# EAGLE design PoE_Atmega_REVC (EAGLE 8.6.0)
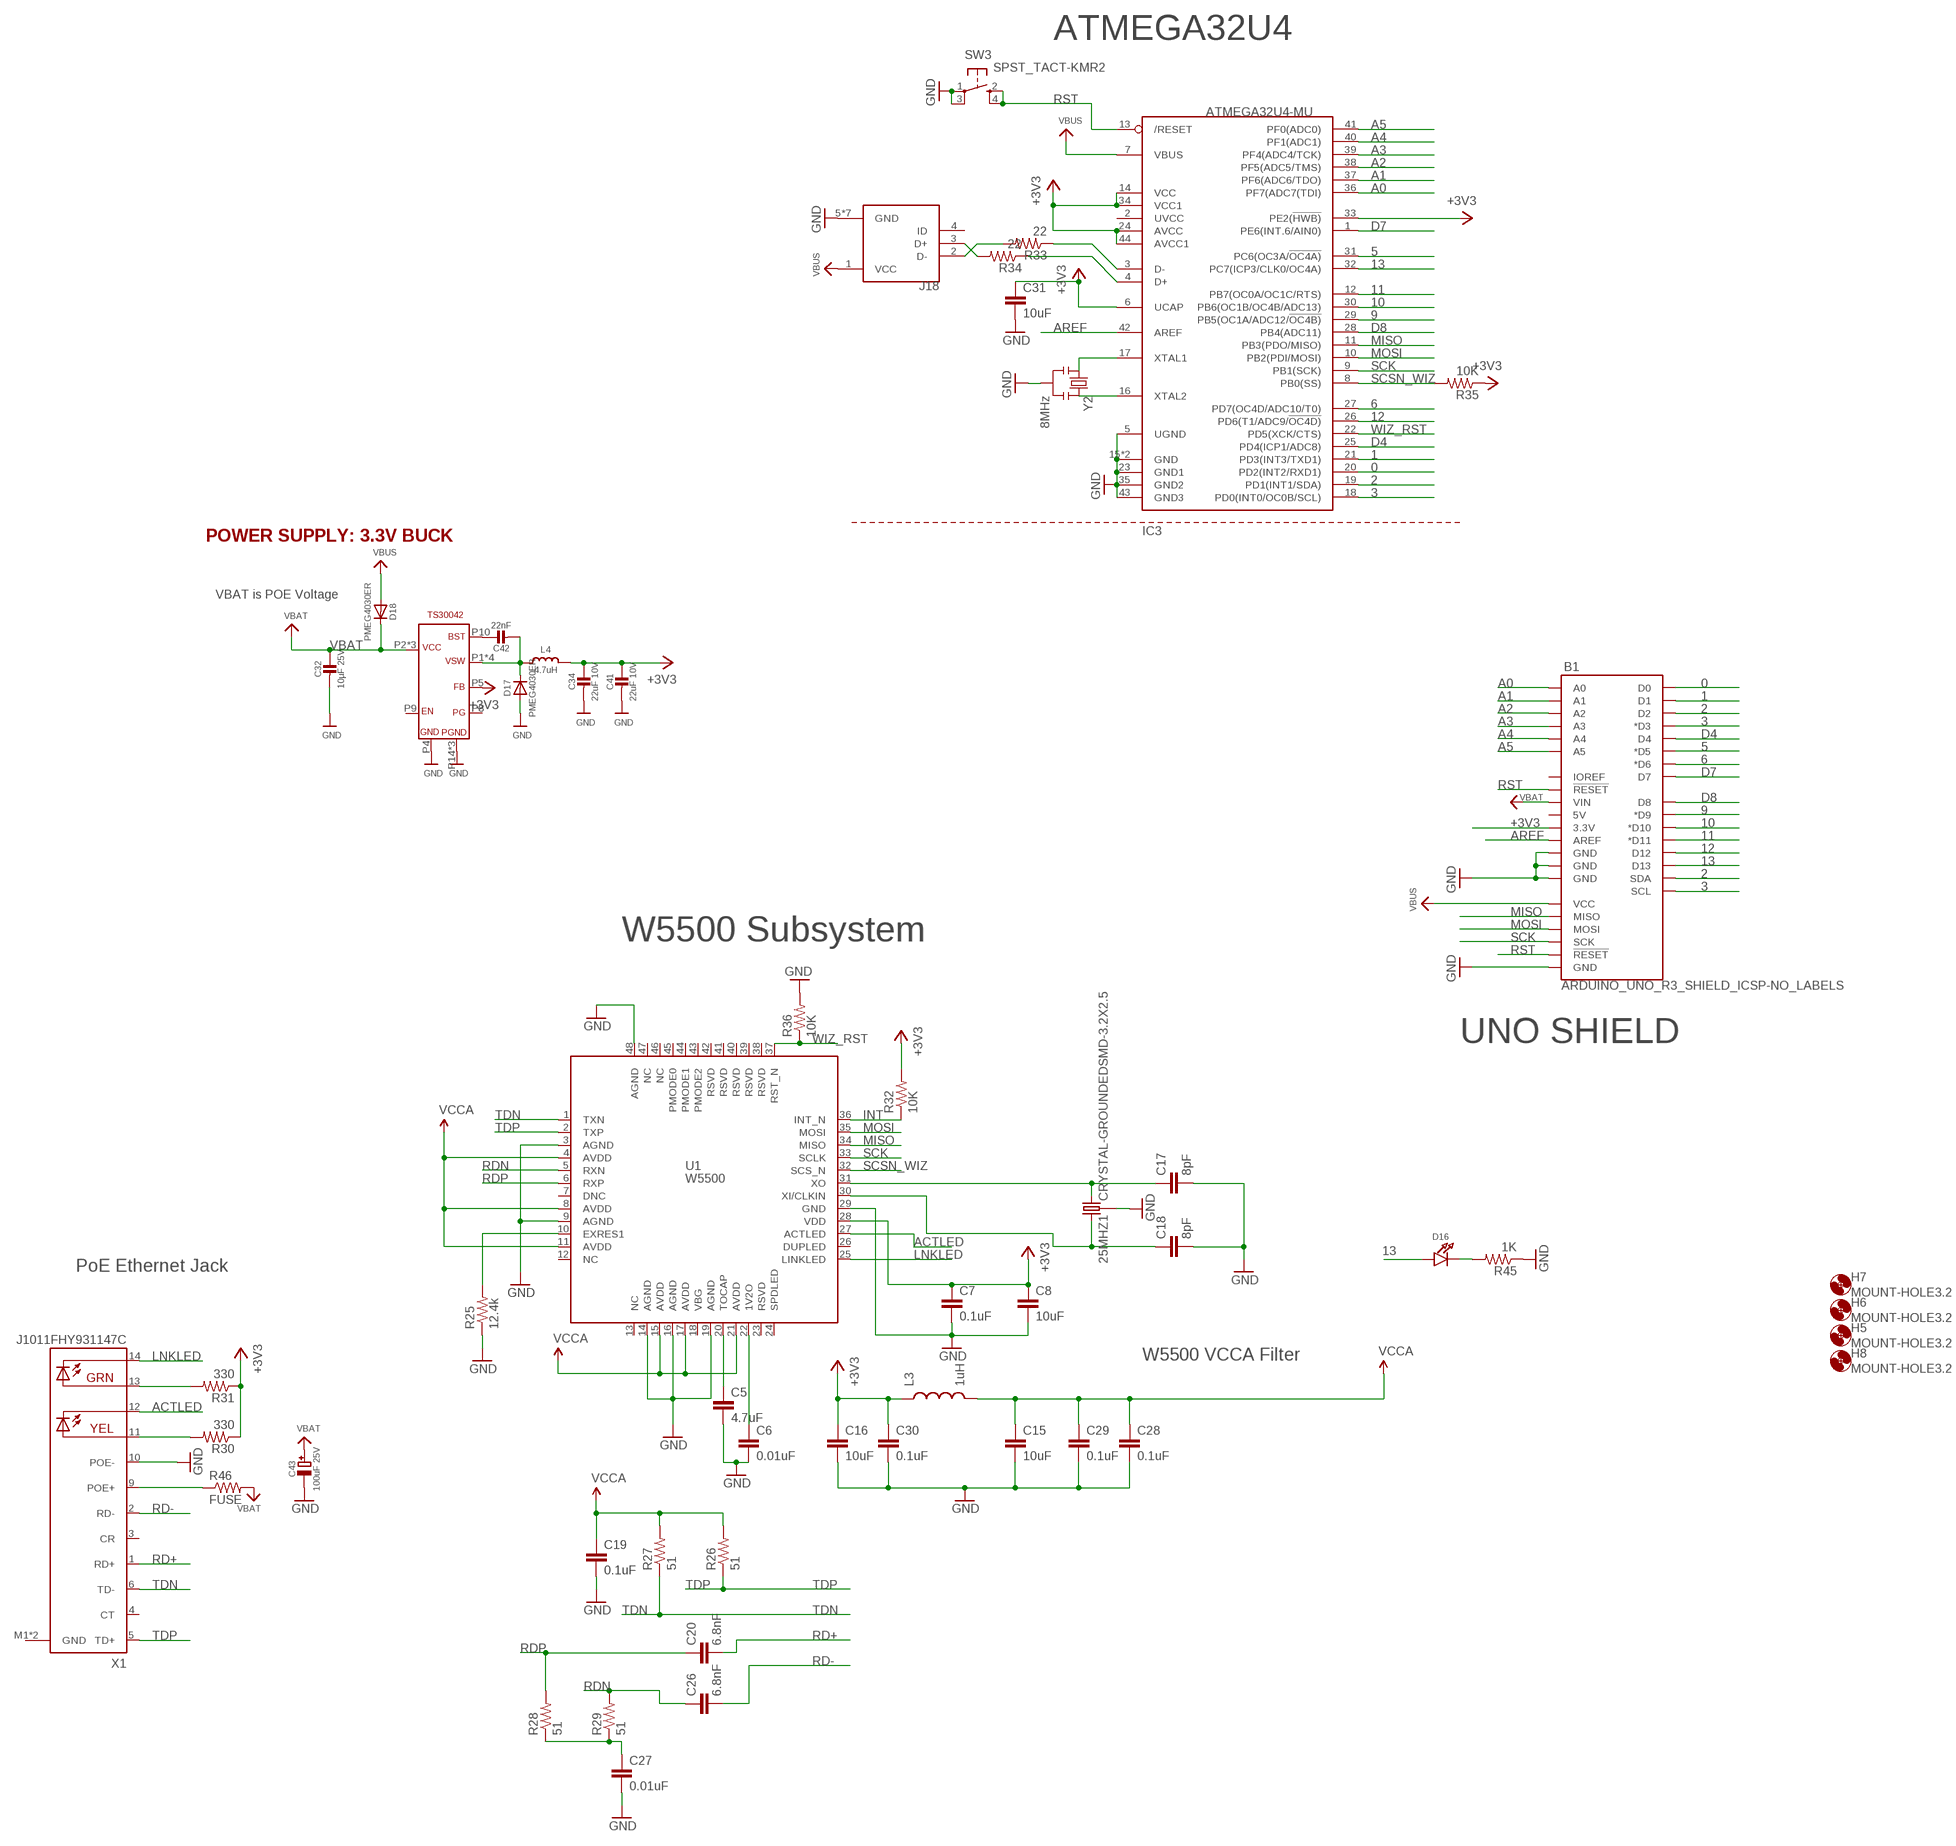
[diagram p0: schematic, sheet 1]

## Parts
25MHZ1  CRYSTAL-GROUNDEDSMD-3.2X2.5  [CRYSTAL-SMD-3.2X2.5MM]
B1  ARDUINO_UNO_R3_SHIELD_ICSP-NO_LABELS  [UNO_R3_SHIELD_ICSP_NOLABELS]
C5  4.7uF  CAP0603-CAP  [0603-CAP]
C6  0.01uF  CAP0603-CAP  [0603-CAP]
C7  0.1uF  CAP0603-CAP  [0603-CAP]
C8  10uF  CAP0603-CAP  [0603-CAP]
C15  10uF  CAP0603-CAP  [0603-CAP]
C16  10uF  CAP0603-CAP  [0603-CAP]
C17  8pF  CAP0603-CAP  [0603-CAP]
C18  8pF  CAP0603-CAP  [0603-CAP]
C19  0.1uF  CAP0603-CAP  [0603-CAP]
C20  6.8nF  CAP0603-CAP  [0603-CAP]
C26  6.8nF  CAP0603-CAP  [0603-CAP]
C27  0.01uF  CAP0603-CAP  [0603-CAP]
C28  0.1uF  CAP0603-CAP  [0603-CAP]
C29  0.1uF  CAP0603-CAP  [0603-CAP]
C30  0.1uF  CAP0603-CAP  [0603-CAP]
C31  10uF  CAP0603-CAP  [0603-CAP]
C32  10µF 25V  CAP_CERAMIC0603MINI  [0603-MINI]
C34  22uF 10V  CAP_CERAMIC0603MINI  [0603-MINI]
C41  22uF 10V  CAP_CERAMIC0603MINI  [0603-MINI]
C42  22nF  CAP_CERAMIC0603MINI  [0603-MINI]
C43  100uF 25V  CAP_ELECTROLYTICPANASONIC_D  [PANASONIC_D]
D16  LED0805_NOOUTLINE  [CHIPLED_0805_NOOUTLINE]
D17  PMEG4030ER  DIODESOD-123  [SOD-123]
D18  PMEG4030ER  DIODESOD-123  [SOD-123]
H5  MOUNT-HOLE3.2  [3,2]
H6  MOUNT-HOLE3.2  [3,2]
H7  MOUNT-HOLE3.2  [3,2]
H8  MOUNT-HOLE3.2  [3,2]
IC3  ATMEGA32U4-MU  [TQFN44_7MM]
J18  10103594-0001LF  [FCI_10103594-0001LF]
L3  1uH  INDUCTOR0603  [0603]
L4  4.7uH  INDUCTORTDK_VLC5045  [INDUCTOR_5X5MM_TDK_VLC5045]
R25  12.4k  RESISTOR0603-RES  [0603-RES]
R26  51  RESISTOR0603-RES  [0603-RES]
R27  51  RESISTOR0603-RES  [0603-RES]
R28  51  RESISTOR0603-RES  [0603-RES]
R29  51  RESISTOR0603-RES  [0603-RES]
R30  330  RESISTOR0603-RES  [0603-RES]
R31  330  RESISTOR0603-RES  [0603-RES]
R32  10K  RESISTOR0603-RES  [0603-RES]
R33  22  RESISTOR0603-RES  [0603-RES]
R34  22  RESISTOR0603-RES  [0603-RES]
R35  10K  RESISTOR0603-RES  [0603-RES]
R36  10K  RESISTOR0603-RES  [0603-RES]
R45  1K  RESISTOR0603-RES  [0603-RES]
R46  FUSE  RESISTOR0603-RES  [0603-RES]
SW3  SPST_TACT-KMR2  [KMR2]
U1  W5500  [W5500]
U$44  BUCK_CONVERTER  [QFN-16]
X1  J1011FHY931147C  [HANRUN_POE]
Y2  8MHz  RESONATORSMD  [RESONATOR-SMD]

## Nets
0: B1.RX(D0) IC3.20(PD2(INT2/RXD1))
1: B1.TX(D1) IC3.21(PD3(INT3/TXD1))
2: B1.D2 B1.SDA IC3.19(PD1(INT1/SDA))
3: B1.D3(*D3) B1.SCL IC3.18(PD0(INT0/OC0B/SCL))
5: B1.D5(*D5) IC3.31(PC6(OC3A/!OC4A))
6: B1.D6(*D6) IC3.27(PD7(OC4D/ADC10/T0))
9: B1.D9(*D9) IC3.29(PB5(OC1A/ADC12/!OC4B))
10: B1.D10(*D10) IC3.30(PB6(OC1B/OC4B/ADC13))
11: B1.D11(*D11) IC3.12(PB7(OC0A/OC1C/RTS))
12: B1.D12 IC3.26(PD6(T1/ADC9/!OC4D))
13: B1.D13 D16.A IC3.32(PC7(ICP3/CLK0/OC4A))
+3V3: B1.3.3V C7.1 C8.1 C16.1 C30.1 C31.1 C34.1 C41.1 IC3.6(UCAP) IC3.14(VCC) IC3.24(AVCC) IC3.33(PE2(!HWB)) IC3.34(VCC1) IC3.44(AVCC1) L3.1 L4.P$2 R30.1 R31.1 R32.2 R35.1 U1.28(VDD) U$44.P5(FB)
A0: B1.A0 IC3.36(PF7(ADC7(TDI))
A1: B1.A1 IC3.37(PF6(ADC6/TDO))
A2: B1.A2 IC3.38(PF5(ADC5/TMS))
A3: B1.A3 IC3.39(PF4(ADC4/TCK))
A4: B1.A4 IC3.40(PF1(ADC1))
A5: B1.A5 IC3.41(PF0(ADC0))
ACTLED: U1.27(ACTLED) X1.12(YEL-C)
AREF: B1.AREF IC3.42(AREF)
D4: B1.D4 IC3.25(PD4(ICP1/ADC8))
D7: B1.D7 IC3.1(PE6(INT.6/AIN0))
D8: B1.D8 IC3.28(PB4(ADC11))
D+2: IC3.4(D+) R34.1
D-2: IC3.3(D-) R33.1
GND: 25MHZ1.2 25MHZ1.4 B1.GND@0(GND) B1.GND@1(GND) B1.GND@2(GND) B1.GND_ICSP(GND) C5.2 C6.2 C7.2 C8.2 C15.2 C16.2 C17.2 C18.2 C19.2 C27.2 C28.2 C29.2 C30.2 C31.2 C32.2 C34.2 C41.2 C43.- D17.A IC3.5(UGND) IC3.15(GND) IC3.23(GND1) IC3.35(GND2) IC3.43(GND3) IC3.THERMAL(GND) J18.5(GND) J18.P1(GND) J18.P2(GND) J18.P3(GND) J18.P4(GND) J18.P5(GND) J18.P6(GND) R25.1 R36.2 R45.1 SW3.1(P) SW3.3(P1) U1.3(AGND) U1.9(AGND) U1.14(AGND) U1.16(AGND) U1.19(AGND) U1.29(GND) U1.48(AGND) U$44.P4(GND) U$44.P14(PGND) U$44.P15(PGND) U$44.PAD(PGND) X1.10(POE-) Y2.2
INT: R32.1 U1.36(INT_N)
LNKLED: U1.25(LINKLED) X1.14(GRN-C)
MISO: B1.MISO IC3.11(PB3(PDO/MISO)) U1.34(MISO)
MOSI: B1.MOSI IC3.10(PB2(PDI/MOSI)) U1.35(MOSI)
N$22: C5.1 U1.20(TOCAP)
N$24: C6.1 U1.22(1V2O)
N$27: R25.2 U1.10(EXRES1)
N$28: C27.1 R28.1 R29.1
N$29: 25MHZ1.3 C17.1 U1.31(XO)
N$30: 25MHZ1.1 C18.1 U1.30(XI/CLKIN)
N$31: IC3.16(XTAL2) Y2.3
N$32: IC3.17(XTAL1) Y2.1
N$33: J18.3(D+) R34.2
N$34: J18.2(D-) R33.2
N$39: D16.C R45.2
N$40: R31.2 X1.13(GRN-A)
N$41: R30.2 X1.11(YEL-A)
N$42: C42.1 U$44.P10(BST)
N$43: C42.2 D17.C L4.P$1 U$44.P1(VSW) U$44.P12(VSW) U$44.P13(VSW) U$44.P16(VSW)
N$44: R46.1 X1.9(POE+)
RD+: C20.2 X1.1(RD+)
RD-: C26.2 X1.2(RD-)
RDN: C26.1 R29.2 U1.5(RXN)
RDP: C20.1 R28.2 U1.6(RXP)
RST: B1.RES(!RESET!) B1.RST_ICSP(!RESET!) IC3.13(/RESET) SW3.2(S) SW3.4(S1)
SCK: B1.SCK IC3.9(PB1(SCK)) U1.33(SCLK)
SCSN_WIZ: IC3.8(PB0(SS)) R35.2 U1.32(SCS_N)
TDN: R27.1 U1.1(TXN) X1.6(TD-)
TDP: R26.1 U1.2(TXP) X1.5(TD+)
VBAT: B1.VIN C32.1 C43.+ D18.C R46.2 U$44.P2(VCC) U$44.P3(VCC) U$44.P11(VCC)
VBUS: B1.5V_ICSP(VCC) D18.A IC3.7(VBUS) J18.1(VCC)
VCCA: C15.1 C19.1 C28.1 C29.1 L3.2 R26.2 R27.2 U1.4(AVDD) U1.8(AVDD) U1.11(AVDD) U1.15(AVDD) U1.17(AVDD) U1.21(AVDD)
WIZ_RST: IC3.22(PD5(XCK/CTS)) R36.1 U1.37(RST_N)
Unconnected: B1.5V B1.IOREF IC3.2(UVCC) J18.4(ID) U1.7(DNC) U1.12(NC) U1.13(NC) U1.18(VBG) U1.23(RSVD) U1.24(SPDLED) U1.26(DUPLED) U1.38(RSVD) U1.39(RSVD) U1.40(RSVD) U1.41(RSVD) U1.42(RSVD) U1.43(PMODE2) U1.44(PMODE1) U1.45(PMODE0) U1.46(NC) U1.47(NC) U$44.P8(PG) U$44.P9(EN) X1.3(CR) X1.4(CT)

## Notes on the sheet
- ATMEGA32U4
- POWER SUPPLY: 3.3V BUCK
- VBAT is POE Voltage
- W5500 Subsystem
- UNO SHIELD
- PoE Ethernet Jack
- W5500 VCCA Filter

## Power pins joined to a net without a drawn wire
GND: X1.M1(GND) X1.M2(GND)

## Library data of the parts
25MHZ1 = SparkFun-Clocks:CRYSTAL-GROUNDED: Crystals w/ Ground Pin (Generic) These are passive quartz crystals, which can be used as a clock source for a microcontroller. Crystal's are usually two-terminal devices. A third terminal may be optionally connected to ground, as recommended by the manufaturer.
B1 = SparkFun-Boards:ARDUINO_UNO_R3_SHIELD_ICSP: Arduino R3 Shield Footprint with ICSP Header Includes pins for 6-pin (2x3) ICSP Header. Compatible with Leonardo boards that require SPI pin connections via this header. SparkFun Products: CryptoShield <https://www.sparkfun.com/products/13183> microSD Shield <https://www.sparkfun.com/products/12761> R3 Stackable Headers Kit <https://www.sparkfun.com/products/1417>
C5-C8 C15-C20 C26-C31 = SparkFun-Passives:CAP: Capacitor Standard 0603 ceramic capacitor, and 0.1" leaded capacitor.
C32 C34 C41 C42 = microbuilder:CAP_CERAMIC: Ceramic Capacitors For new designs, use the packages preceded by an '_' character since they are more reliable: The following footprints should be used on most boards: _0402 - Standard footprint for regular board layouts _0603 - Standard footprint for regular board layouts _0805 - Standard footprint for regular board layouts _1206 - Standard footprint for regular board layouts For extremely tight-pitch boards where space is at a premium, the following 'micro-pitch' footprints can be used (smaller pads, no silkscreen outline, etc.): _0402MP - Micro-pitch footprint for very dense/compact boards _0603MP - Micro-pitch footprint for very dense/compact boards _0805MP - Micro-pitch footprint for very dense/compact boards _1206MP - Micro-pitch footprint for very dense/compact boards
C43 = microbuilder:CAP_ELECTROLYTIC: Electrolytic Capacitors SMT PANASONIC_C - Size C Panasonic Electrolytic Aluminum Capacitor 47µF 16V 20% Electrolytic Capacitor [Digikey: PCE3890TR-ND] PANASONIC_D - Size D Panasonic Electrolytic Aluminum Capacitor 100µF 25V 20% Electrolytic Capacitor [Digikey: PCE3898TR-ND] PTH 3.5 mm grid, 8 mm diameter ... 3.5 mm grid, 10 mm diameter ...
D16 = microbuilder:LED: LED 0603 - 0603 Surface Mount Package 2mA: Green LED - Low Power (3.9mcd, 2ma, 1.7Vf) - Digikey: 475-2709-2-ND Orange LED - Low Power (9.8mcd, 2ma, 1.8Vf) - Digikey: 475-1194-2-ND Red LED - Low Power (5mcd, 2ma, 1.8Vf) - Digikey: 475-1195-2-ND Yellow LED - Low Power (7mcd, 2ma, 1.8Vf) - Digikey: 475-1196-2-ND 5mA: Blue LED - Low Power (17mcd, 5ma, 2.9Vf) - Digikey: LNJ937W8CRACT-ND 0805 - 0805 Surface Mount Package 2mA: Red LED (8.8mcd, 2mA, 1.8Vf, Clear) - Low Power [Digikey: 475-2510-1-ND] Green LED (5mcd, 2mA, 1.8Vf, Clear) - Low Power [Digikey: 475-2730-1-ND] Yellow LED (11.3mcd, 2mA, 1.8Vf, Clear) - Low Power [Digikey: 475-2555-1-ND] 20mA: Red LED (104mcd, 20mA, Diffused) - LS R976 [Digikey: 475-1278-6-ND] Red LED (12mcd, 20mA, 2.0Vf, Clear) - APT2012EC [Digikey: 754-1128-1-ND] Green LED (15mcd, 20mA, 2.2Vf, Clear) - APT2012GC [Digikey: 754-1131-1-ND] Orange LED (160mcd, 20mA, 2.1Vf, Clear) - APT2012SECK [Digikey: 754-1130-1-ND] 1206 - 1206 Surface Mount Package Green LED (26mcd, 20mA, Diffused) - LG N971 [Digikey: 475-1407-6-ND] Red LED (15mcd, 20mA, Diffused) - LH N974 [Digikey: 475-1416-6-ND] Cree - Cree High-Power Surface Mount LEDs XPEBWT-L1-0000-00D50 - White 111lm 350mA 2.9Vf 6200K 110° XTEAWT-00-0000-00000LEE3 - White 114lm 350mA 2.85Vf 5000K 115° Everlight - Everlight 45-21 Series Surface Mount LEDs 45-21/QK2C-B2832AC2CB2/2T - Warm White 2000mcd 20mA 3.25Vf 3050K 120° 45-21/LK2C-B38452C4CB2/2T - Nuetral White 2000mcd 20mA 3.25Vf 4150K 120° 45-21/LK2C-B50634C6CB2/2T - Cold White 2200mcd 20mA 3.25Vf 5650K 120° PLCC2 Reverse Mount LS T77K-J1L2-1-0-2-R18-Z - Red 11.25mcd 2mA 1.8Vf 630nm 120° LO T77K-L1M2-24-Z - Orange 19.6mcd 2mA 1.8Vf 606nm 120° LY T77K-K2M1-26-Z - Yellow 15.7mcd 2mA 1.8Vf 587nm 120°
D17 D18 = microbuilder:DIODE: Diode SMA Model Volts Amps Type Vf Ir Digikey # Notes SSA34-E3 40V 3A Schottky 480mV @ 3A 200uA @ 40V SSA34-E3/61TGITR-ND CDBA120-G 20V 1A Schottky 500mV @ 1A 500uA @ 20V 641-1014-6-ND REEL MBRA210 10V 2A Schottky 350mV @ 2A 700uA @ 10V MBRA210LT3 SOD-123 Model Volts Amps Type Vf Ir Order # Notes BAT54T1G 30V 200mA Schottky 800mV @ 200mA 2uA @ 25V BAT54T1GOSTR-ND B0530W 30V 500mA Schottky 430mV @ 500mA 130uA @ 30V B0530W-FDICT-ND REEL MBR120 20V 1A Schottky 340mV @ 1A MBR120VLSFT1GOSCT-ND SOD-323 Model Volts Amps Type Vf Ir Order # Notes PMEG2005EJ 20V 500mA Schottky 355mV @ 500mA 568-4110-1-ND ZLLS410 10V 570mA Schottky 380mV @ 570mA ZLLS410CT-ND 1N4148WS 75V 150mA Silicon/Simple 1V 1N4148WSFSCT-ND REEL SOD-523 Model Volts Amps Type Vf Ir Order # Notes BAT54XV2 30V 200mA Schottky 0.8V @ 100mA BAT54XV2CT-ND TB751S 30V 30mA Schottky RB751S-40TE61CT-ND SOT23-R/W (R = Solder Paste/Reflow Ovens, W = Hand-Soldering) Model Volts Amps Type Vf Ir Order # Notes BAT54FILM 40V 300mA Schottky 497-7162-1-ND POWERDI-5 Model Volts Amps Type Vf Ir Order # Notes PDS560 60V 5A Schottky 670mV @ 5A 150uA @ 60V PDS560DICT-ND
H5-H8 = holes:MOUNT-HOLE: MOUNTING HOLE with drill center marker
IC3 = microbuilder:ATMEGA32U4: http://www.ladyada.net/library/eagle
J18 = 10103594-0001LF:10103594-0001LF: Conn Micro USB Type B RCP 5 POS 0.65mm Solder RA SMD 5 Terminal 1 Port T/R; AVAILABILITY: Good; DESCRIPTION: Conn Micro USB Type B RCP 5 POS 0.65mm Solder RA SMD 5 Terminal 1 Port T/R; MF: FCI; MP: 10103594-0001LF; PACKAGE: None; PRICE: 0.40 USD
L3 = SparkFun-Passives:INDUCTOR: Inductors
L4 = microbuilder:INDUCTOR: Inductors
R25-R36 R45 R46 = SparkFun-Passives:RESISTOR: Resistor Basic schematic elements and footprints for 0603, 1206, and PTH resistors.
SW3 = adafruit:SPST_TACT: SMT 6mm switch, EVQQ2 series http://www.ladyada.net/library/eagle
U1 = W5500:W5500
U$44 = Heep:BUCK_CONVERTER
X1 = Heep:J1011F: PULSEJACK (TM) 1x1 Tab-UP RJ45 10/100 Base-TX RJ45 1x1 Tab-UP with LEDs 8-pin (J1 series) and 6-pin (JP series) integrated magnetics connector, designed to support applications, such as ADSL modems, LAN-on-Motherboard, and Hub and Switches. Source: www.pulseeng.com .. PulseJack-J402.pdf
Y2 = SparkFun:RESONATOR: Resonator Small SMD resonator. This is the itty bitty 10/20MHz resonators with built in caps. CSTCE10M0G55 and CSTCE20M0V53. Footprint has been reviewed closely but hasn't been tested yet.

## Net classes
1 power: width 0.305 mm, drill 0.483 mm, clearance 0.203 mm
2 gnd: width 0.305 mm, drill 0.483 mm, clearance 0.203 mm
3 usbvcc: width 0.305 mm, drill 0.483 mm, clearance 0.203 mm

## Board
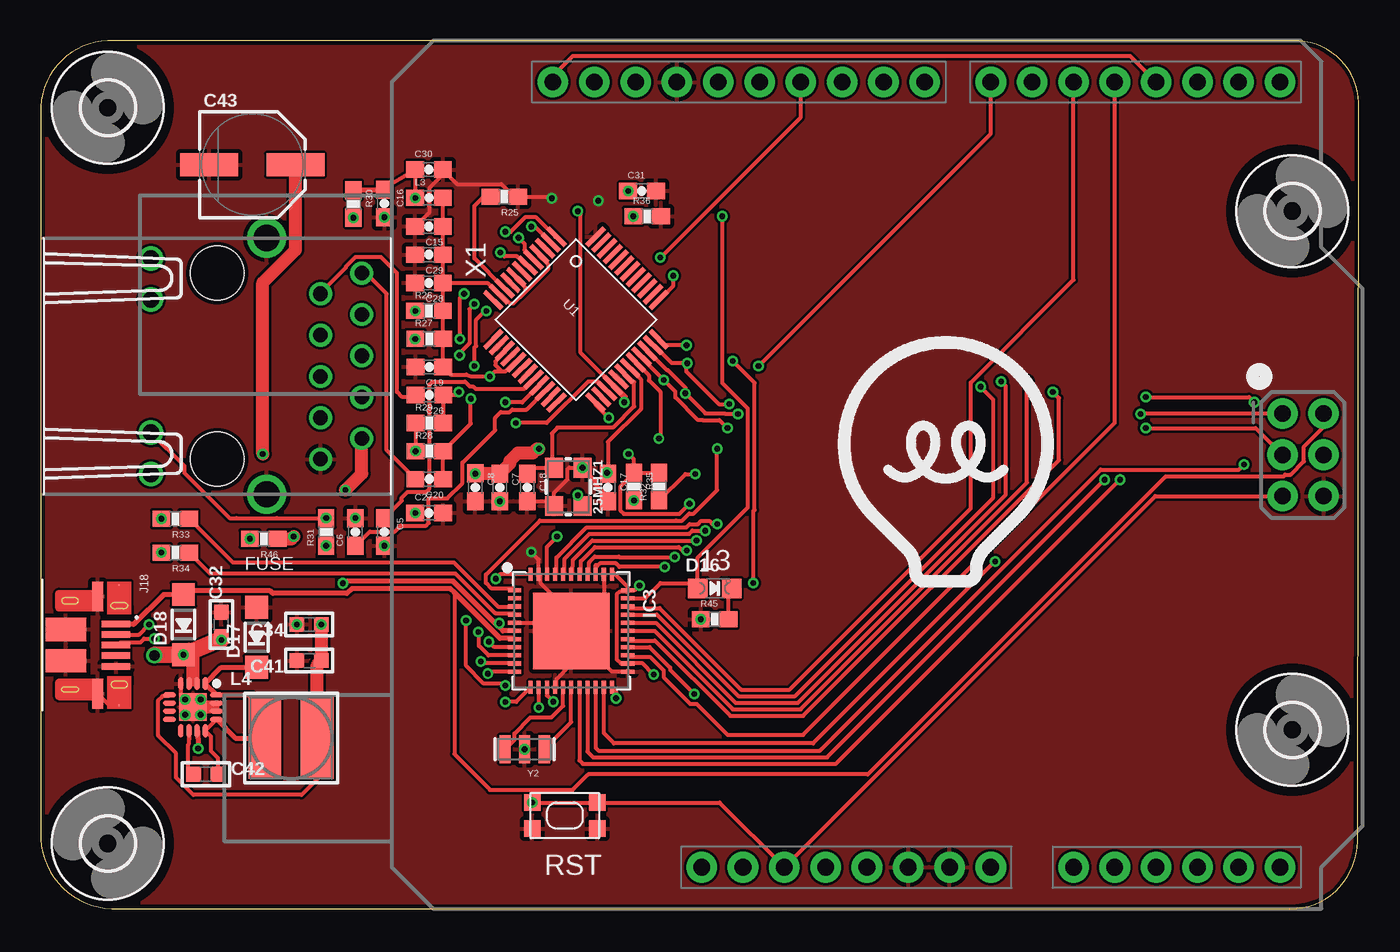
[diagram p1: board, top side]
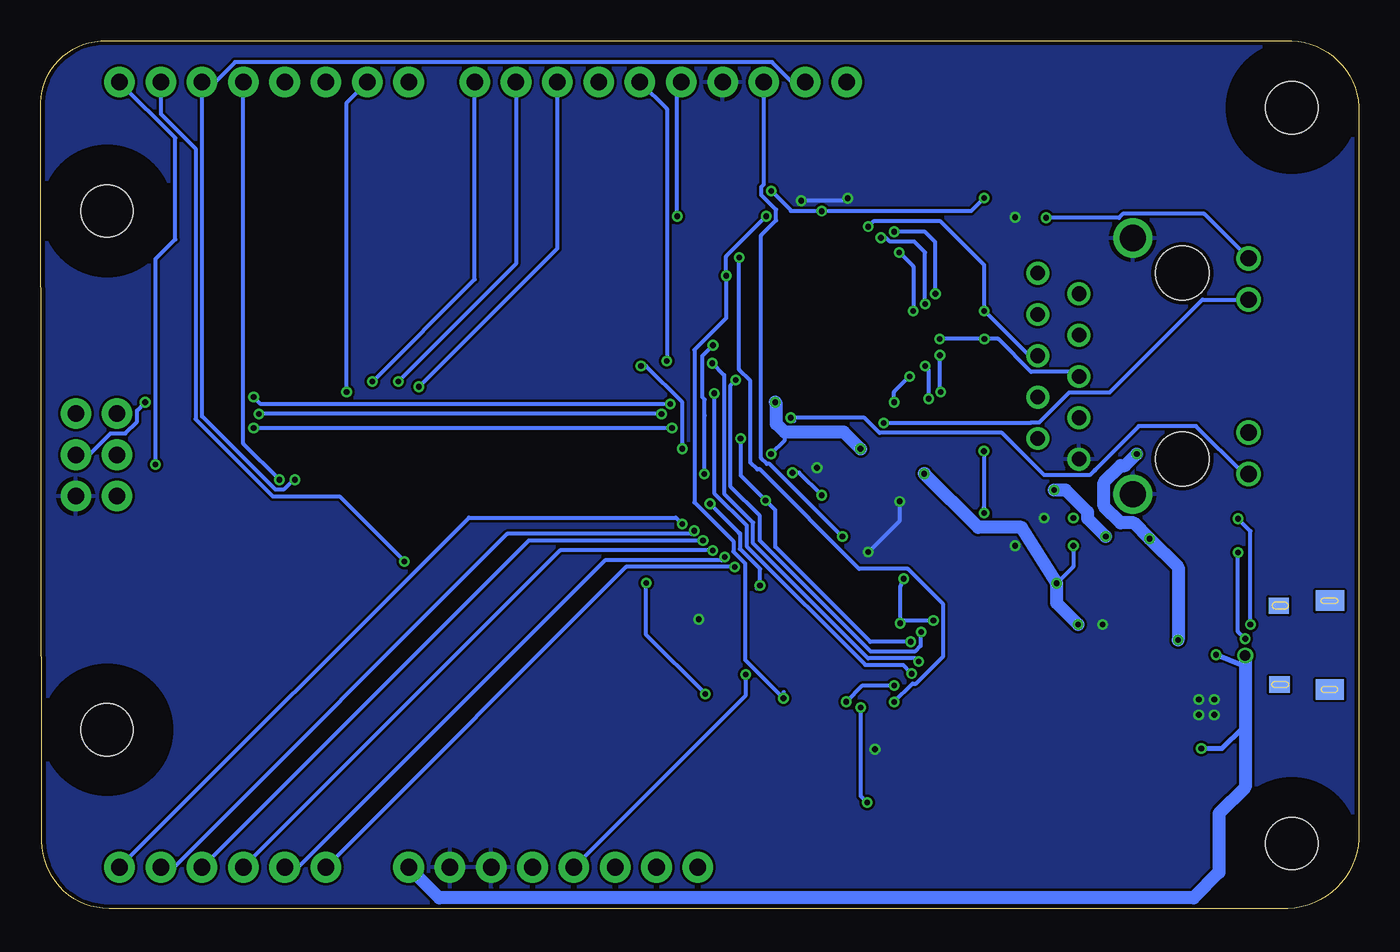
[diagram p2: board, bottom side, seen from below]

Size 81.04 x 53.34 mm. Coordinates in mm from the lower left corner, seen from the top.
Outline: 4.37,0 76.84,0 arc90 80.96,4.13 81.04,49.53 arc90 77,53.33 4.13,53.34 arc90 0,48.9 0,4.68 arc90 4.37,0
Copper layers (1*16): Top 0.035mm / dielectric 1.5mm / Bottom 0.035mm
Design rules "SeeedStudio_2layer_DRU_no_angle_20140221": minimum track width 6mil, minimum drill 12mil, track to track 6mil, track to pad 6mil, pad to pad 6mil, via to via 6mil, smd to smd 0mil, copper to edge 10mil, drill to drill 10mil, minimum pad ring 10mil, minimum via ring 6mil, stop-mask expansion 2mil, vias tented up to drill 100mil, thermal gap 10mil

### Footprints (pad centres in the part's own frame; a part is rotated, then mirrored left to right if it is on the bottom)
CRYSTAL-SMD-3.2X2.5MM = smd 1.2 x 1.1: 1 -1.175,-0.875; 2 1.175,-0.875; 3 1.175,0.875; 4 -1.175,0.875
UNO_R3_SHIELD_ICSP_NOLABELS = drill 1.016 pad 1.88: 3.3V 24.13,-3.81; 5V 24.13,-1.27; 5V_ICSP -3.76,26.81; A0 24.13,11.43; A1 24.13,13.97; A2 24.13,16.51; A3 24.13,19.05; A4 24.13,21.59; A5 24.13,24.13; AREF -24.13,-15.494; D2 -24.13,19.05; D3 -24.13,16.51; D4 -24.13,13.97; D5 -24.13,11.43; D6 -24.13,8.89; D7 -24.13,6.35; D8 -24.13,2.286; D9 -24.13,-0.254; D10 -24.13,-2.794; D11 -24.13,-5.334; D12 -24.13,-7.874; D13 -24.13,-10.414; GND@0 24.13,1.27; GND@1 24.13,3.81; GND@2 -24.13,-12.954; GND_ICSP 1.32,26.81; IOREF 24.13,-8.89; MISO -3.76,24.27; MOSI -1.22,26.81; NC 24.13,-11.43; RES 24.13,-6.35; RST_ICSP 1.32,24.27; RX -24.13,24.13; SCK -1.22,24.27; SCL -24.13,-20.574; SDA -24.13,-18.034; TX -24.13,21.59; VIN 24.13,6.35
0603-CAP = smd 1.1 x 1: 1 -0.85,0; 2 0.85,0
0603-MINI = smd 0.9 x 0.9: 1 -0.75,0; 2 0.75,0
PANASONIC_D = smd 3.556 x 1.4: + 2.654,0; - -2.654,0
CHIPLED_0805_NOOUTLINE = smd 1.2 x 1.2: A 0,-1.05; C 0,1.05
SOD-123 = smd 1.4 x 1.4: A 1.85,0; C -1.85,0
3,2 = hole 3.2: 0,0
TQFN44_7MM = smd 0.25 x 0.8: 1 -2.5,-3.475; 2 -2,-3.475; 3 -1.5,-3.475; 4 -1,-3.475; 5 -0.5,-3.475; 6 0,-3.475; 7 0.5,-3.475; 8 1,-3.475; 9 1.5,-3.475; 10 2,-3.475; 11 2.5,-3.475; 23 2.5,3.475; 24 2,3.475; 25 1.5,3.475; 26 1,3.475; 27 0.5,3.475; 28 0,3.475; 29 -0.5,3.475; 30 -1,3.475; 31 -1.5,3.475; 32 -2,3.475; 33 -2.5,3.475 | smd 0.8 x 0.25: 12 3.475,-2.5; 13 3.475,-2; 14 3.475,-1.5; 15 3.475,-1; 16 3.475,-0.5; 17 3.475,0; 18 3.475,0.5; 19 3.475,1; 20 3.475,1.5; 21 3.475,2; 22 3.475,2.5; 34 -3.475,2.5; 35 -3.475,2; 36 -3.475,1.5; 37 -3.475,1; 38 -3.475,0.5; 39 -3.475,0; 40 -3.475,-0.5; 41 -3.475,-1; 42 -3.475,-1.5; 43 -3.475,-2; 44 -3.475,-2.5 | smd 4.7 x 4.7: THERMAL 0,0
FCI_10103594-0001LF = smd 0.4 x 1.75: 1 -1.3,2.825; 2 -0.65,2.825; 3 0,2.825; 4 0.65,2.825; 5 1.3,2.825 | smd 0.1 x 0.1: P1 -3.7,3; P2 3.7,3 | smd 1.825 x 0.7: P3 -2.987,1.7; P4 2.987,1.7 | smd 1.425 x 2.5: P5 -0.963,-0.25; P6 0.963,-0.25 | smd 1.25 x 1.75 bottom: P$1 -2.731,-0.026; P$2 2.726,-0.018 | smd 1 x 1.25 bottom: P$3 -2.422,3.111; P$4 2.427,3.078
0603 = smd 1.1 x 1: 1 -0.85,0; 2 0.85,0
INDUCTOR_5X5MM_TDK_VLC5045 = smd 2 x 5: P$1 -1.6,0; P$2 1.6,0
0603-RES = smd 1.1 x 1: 1 -0.85,0; 2 0.85,0
KMR2 = smd 1 x 1: 1 2,0.8; 2 2,-0.8; 3 -2,0.8; 4 -2,-0.8
W5500 = smd 1.5 x 0.3: 1 -4.45,2.75; 2 -4.45,2.25; 3 -4.45,1.75; 4 -4.45,1.25; 5 -4.45,0.75; 6 -4.45,0.25; 7 -4.45,-0.25; 8 -4.45,-0.75; 9 -4.45,-1.25; 10 -4.45,-1.75; 11 -4.45,-2.25; 12 -4.45,-2.75; 25 4.45,-2.75; 26 4.45,-2.25; 27 4.45,-1.75; 28 4.45,-1.25; 29 4.45,-0.75; 30 4.45,-0.25; 31 4.45,0.25; 32 4.45,0.75; 33 4.45,1.25; 34 4.45,1.75; 35 4.45,2.25; 36 4.45,2.75 | smd 0.3 x 1.5: 13 -2.75,-4.45; 14 -2.25,-4.45; 15 -1.75,-4.45; 16 -1.25,-4.45; 17 -0.75,-4.45; 18 -0.25,-4.45; 19 0.25,-4.45; 20 0.75,-4.45; 21 1.25,-4.45; 22 1.75,-4.45; 23 2.25,-4.45; 24 2.75,-4.45; 37 2.75,4.45; 38 2.25,4.45; 39 1.75,4.45; 40 1.25,4.45; 41 0.75,4.45; 42 0.25,4.45; 43 -0.25,4.45; 44 -0.75,4.45; 45 -1.25,4.45; 46 -1.75,4.45; 47 -2.25,4.45; 48 -2.75,4.45
QFN-16 = smd 0.8 x 0.3: P1 -1.45,0.75; P2 -1.45,0.25; P3 -1.45,-0.25; P4 -1.45,-0.75; P9 1.45,-0.75; P10 1.45,-0.25; P11 1.45,0.25; P12 1.45,0.75 | smd 0.3 x 0.8: P5 -0.75,-1.45; P6 -0.25,-1.45; P7 0.25,-1.45; P8 0.75,-1.45; P13 0.75,1.45; P14 0.25,1.45; P15 -0.25,1.45; P16 -0.75,1.45 | smd 1.7 x 1.7: PAD 0,0
HANRUN_POE = drill 0.9 pad 1.3: 1 5.715,-8.89; 2 4.445,-6.35; 3 3.175,-8.89; 4 1.905,-6.35; 5 0.635,-8.89; 6 -0.635,-6.35; 7 -1.905,-8.89; 8 -3.175,-6.35; 9 -4.445,-8.89; 10 -5.715,-6.35 | drill 1 pad 1.422: 11 6.625,4.08; 12 4.085,4.08; 13 -4.085,4.08; 14 -6.625,4.08 | drill 1.6 pad 2.184: M1 7.875,-3.05; M2 -7.875,-3.05 | hole 3.3: -5.715,0; 5.715,0
RESONATOR-SMD = smd 0.7 x 1.7: 1 -1.2,0; 2 0,0; 3 1.2,0

### Placement (x,y rotation side)
25MHZ1  32.44,25.92 270 top
B1  52.07,26.67 270 top
C5  21.13,23.15 270 top
C6  19.36,23.15 90 top
C7  28.22,25.88 270 top
C8  26.72,25.89 270 top
C15  23.88,41.92 180 top
C16  21.13,43.34 270 top
C17  34.88,25.88 270 top
C18  29.91,25.88 270 top
C19  23.89,33.29 180 top
C20  23.89,26.39 180 top
C26  23.91,31.57 180 top
C27  23.88,24.32 0 top
C28  23.88,38.46 180 top
C29  23.88,40.19 180 top
C30  23.88,45.42 0 top
C31  36.97,44.11 0 top
C32  11.11,17.46 90 top
C34  16.51,17.46 180 top
C41  16.51,15.24 180 top
C42  10.16,8.25 0 top
C43  13.02,45.72 0 top
D16  41.43,19.68 270 top
D17  13.27,16.68 90 top
D18  8.78,17.45 90 top
H5  76.96,10.99 0 top
H6  76.96,42.87 0 top
H7  4.13,4 270 top
H8  4.13,49.22 0 top
IC3  32.62,17.06 270 top
J18  1.8,16.19 270 top
L3  23.88,43.68 0 top
L4  15.4,10.48 0 top
R25  28.51,43.75 180 top
R26  23.88,36.73 0 top
R27  23.88,35.02 0 top
R28  23.9,28.11 0 top
R29  23.9,29.84 0 top
R30  19.23,43.31 270 top
R31  17.55,23.15 90 top
R32  38.01,25.93 90 top
R33  8.28,23.95 180 top
R34  8.28,21.88 180 top
R35  36.47,25.93 270 top
R36  37.29,42.55 0 top
R45  41.43,17.78 0 top
R46  13.72,22.73 180 top
SW3  32.23,5.71 180 top
U1  32.91,36.2 315 top
U$2  [HEEPLOGO]  46.67,18.1 0 top
U$44  9.37,12.38 270 top
X1  10.86,33.34 90 top
Y2  29.75,9.79 180 top

### Tracks (layer width: path | path; a pad name or v marks a point on that pad's centre or on a via)
0  (via drill 0.35)
  Top 0.254: v73.98,27.28 73.67,26.98 65.17,26.98 47.9,9.7 34.29,9.7 34.12,9.87 IC3.20
  Bottom 0.254: v73.98,27.28 73.98,39.92 72.77,41.13 72.77,47.37 B1.RX
1  (via drill 0.35)
  Top 0.254: v58.67,21.34 47.5,10.16 35.24,10.16 34.62,10.78 IC3.21
  Bottom 0.254: B1.TX 73.66,48.84 71.53,46.7 71.53,30.09 66.78,25.34 62.68,25.34 v58.67,21.34
2  (via drill 0.35)
  Top 0.254: IC3.19 33.62,9.65 33.97,9.3 48.35,9.3 v65.4,26.35
  Bottom 0.254: B1.SDA 34.85,50.8 36.07,52.02 69.09,52.02 70.3,50.8 B1.D2 71.12,30.26 66.61,25.75 66.11,25.75 65.5,26.35 v65.4,26.35
3  (via drill 0.35)
  Top 0.254: B1.D3 66.99,52.39 32.7,52.39 31.75,51.44 31.43,51.44 31.43,50.86 B1.SCL | v66.36,26.35 48.89,8.89 33.34,8.89 33.12,9.11 IC3.18
  Bottom 0.254: v66.36,26.35 68.58,28.58 B1.D3
5
  Top 0.254: IC3.31 36.19,18.47 38.06,18.47 43.07,13.46 46.04,13.46 57.18,24.6 57.18,32.32 63.5,38.64 B1.D5
6  (via drill 0.35)
  Top 0.254: IC3.27 36.19,16.47 37.76,16.47 42.4,11.84 46.88,11.84 62.61,27.56 62.61,31.37 v62.23,31.75
  Bottom 0.254: v62.23,31.75 62.23,49.53 B1.D6
9  (via drill 0.35)
  Top 0.254: IC3.29 37.82,17.56 42.73,12.65 46.55,12.65 59.33,25.44 59.33,32.11 v59.06,32.38
  Bottom 0.254: B1.D9 51.82,39.62 v59.06,32.38
10  (via drill 0.35)
  Top 0.254: IC3.30 37.89,18.06 42.9,13.06 46.38,13.06 58.57,25.25 58.57,31.28 v57.79,32.07
  Bottom 0.254: v57.79,32.07 49.28,40.58 B1.D10
11  (via drill 0.35)
  Top 0.254: IC3.12 29.23,12.7 v28.57,12.7 | v38.1,40.01 46.74,48.64 B1.D11
  Bottom 0.254: v28.57,12.7 27.44,13.83 27.24,13.83 25.55,15.52 25.55,18.69 27.74,20.88 30.72,20.88 36.83,26.99 36.99,26.99 37.4,27.41 37.4,32.43 38.1,33.13 v38.1,40.01
12  (via drill 0.35)
  Top 0.254: v40.18,13.19 38.7,14.67 38.7,14.8 37.44,16.06 IC3.26 | v43.82,20 43.82,24.42 43.89,24.49 43.89,32.31 v42.54,33.66
  Bottom 0.254: B1.D12 42.54,49.15 v42.54,33.66 | v40.18,13.19 43.82,16.83 v43.82,20
13  (via drill 0.35)
  Top 0.254: IC3.32 37.16,19.06 38.1,20 40.07,20 D16.A 40.38,21.57 43.48,24.66 43.48,30.72 41.91,32.29 v41.91,42.55
  Bottom 0.254: v41.91,42.55 41.91,50.55 B1.D13
+3V3  (via drill 0.35)
  Top 0.254: C16.1 20.97,44.19 C30.1 L3.1 | C8.1 v26.73,26.73 | R35.1 R32.2 | U1.28 33.19,34.15 33.19,42.69 v33.02,42.86 | U$44.P5 7.85,13.06 7.49,13.06 7.24,12.81 7.24,10.63 8.32,9.55 8.32,8.05 9.38,6.98 16.03,6.98 17.14,8.1 17,8.24 L4.P$2 | R35.1 36.47,27.6 v36.14,27.94 | R35.1 35.66,25.96 35.66,24.45 35.67,24.45 35.86,24.25 39.27,24.25 v39.89,24.88 | IC3.34 35.12,20.72 36.1,19.75 IC3.33 | IC3.33 36,19.47 35.58,19.47 35.42,19.3 35.42,15.32 35.68,15.06 IC3.24 37.01,15.06 v37.69,14.38 | v36.82,19.86 36.53,19.57 IC3.33 | IC3.44 28.25,20.54 v27.99,20.27 | v28.2,17.53 28.2,17.36 28.17,17.32 | IC3.14 31.12,13.1 v31.51,12.71 | v28.57,13.71 28.29,13.83 27.24,13.83 26.16,14.91 v26.16,17.7
  Top 0.305: IC3.6 28.42,17.06 28.17,17.32 25.36,20.12 18.7,20.12 v18.57,20 | R30.1 19.26,44.19 20.97,44.19
  Top 0.35: 35.88,31.46 U1.28
  Top 0.406: v35.88,31.12 35.88,31.46
  Top 0.813: C34.1 C41.1 17,14.98 L4.P$2 | v26.73,26.73 C7.1 28.85,27.36 28.85,27.52 29.35,28.01 30.25,28.01 30.5,28.26 v30.64,28.26
  Bottom 0.254: v36.14,27.94 35.29,28.79 35.29,29.28 | 37,19.67 v36.82,19.86 36.82,20.88 38.05,22.11 38.05,23.09 38.11,23.09 v39.89,24.88 | v27.99,20.27 28.2,19.74 v28.2,17.53 28.03,17.7 v26.16,17.7 | v31.51,12.71 30.51,13.71 v28.57,13.71 | R31.1 17.55,21.02 v18.57,20 | L3.1 23.84,42.86 v33.02,42.86 34.93,42.86 34.93,42.91 C31.1 | B1.3.3V 37.69,13.11 v37.69,14.38
  Bottom 0.305: v18.57,20
  Bottom 0.813: v26.73,26.73 26.69,26.73 23.4,23.43 20.73,23.43 v18.57,20 | v30.64,28.26 31.66,29.28 35.29,29.28 35.81,29.8 35.81,31.05 v35.88,31.12 | C34.1 18.57,18.78 v18.57,20
  other vias: 17.26,17.46 17.55,22.3 23.03,43.68 36.12,44.11
A0  (via drill 0.35)
  Top 0.254: IC3.36 34.12,20.95 | 34.12,20.95 34.12,21.1 | v38.37,21 35.58,21 35.36,21.22 34.38,21.22 34.22,21.05 34.12,20.95
  Bottom 0.254: v38.37,21 45.04,21 B1.A0
A1  (via drill 0.35)
  Top 0.254: IC3.37 33.72,20.63 33.72,21.27 34.07,21.62 35.53,21.62 35.55,21.61 v38.98,21.61
  Bottom 0.254: v38.98,21.61 39.18,21.41 46.36,21.41 65.22,2.54 B1.A1
A2  (via drill 0.35)
  Top 0.254: IC3.38 33.22,20.63 33.22,21.35 34.08,22.21 39.23,22.21 39.43,22.01 v39.72,22.01
  Bottom 0.254: v39.72,22.01 49.11,22.01 B1.A2
A3  (via drill 0.35)
  Top 0.254: IC3.39 32.72,20.63 32.72,21.05 32.72,21.42 33.91,22.62 v40.32,22.62
  Bottom 0.254: v40.32,22.62 51.04,22.62 B1.A3
A4  (via drill 0.35)
  Top 0.254: IC3.40 32.22,20.63 32.22,21.5 33.74,23.02 39.87,23.02 40.07,23.23 v40.86,23.23
  Bottom 0.254: v40.86,23.23 41.06,23.02 52.36,23.02 72.84,2.54 B1.A4
A5  (via drill 0.35)
  Top 0.254: IC3.41 31.72,20.63 31.72,21.57 33.58,23.43 39.7,23.43 39.9,23.63 40.41,23.63 40.61,23.83 41.11,23.83 41.31,23.63 v41.59,23.63
  Bottom 0.254: B1.A5 54.71,24.03 41.99,24.03 v41.59,23.63
ACTLED  (via drill 0.35)
  Top 0.254: U1.27 34.25,32.38 33.65,32.38 31.11,29.84 v29.21,29.84
  Bottom 0.254: v29.21,29.84 20.18,29.84 20.15,29.88 19.65,29.88 17.81,31.72 15.32,31.72 9.61,37.42 X1.12
AREF  (via drill 0.35)
  Top 0.254: IC3.42 31.12,22.23 v31.75,22.86
  Bottom 0.254: v31.75,22.86 36.23,27.34 36.39,27.34 36.74,27.69 36.74,41.38 35.83,42.29 35.83,42.96 36.73,43.85 36.73,44.36 36.58,44.51 B1.AREF
D4
  Top 0.254: IC3.25 36.19,15.47 37.46,15.47 38.3,14.63 38.3,14.22 39.93,12.59 40.32,12.59 42.23,10.68 46.88,10.68 66.04,29.84 B1.D4
D7  (via drill 0.35)
  Top 0.254: IC3.1 29.04,19.67 27.74,19.67 27.38,20.02 27.38,20.52 30.7,23.84 39.05,23.84 39.06,23.85 39.44,23.85 39.86,24.27 40.14,24.27 41.59,25.72 v41.59,28.26 | v44.13,33.34 58.42,47.62 B1.D7
  Bottom 0.254: v41.59,28.26 41.59,31.12 43.82,33.34 v44.13,33.34
D8  (via drill 0.35)
  Top 0.254: IC3.28 37.74,17.06 42.56,12.24 46.71,12.24 60.64,26.17 v60.64,32.38
  Bottom 0.254: v60.64,32.38 54.36,38.67 B1.D8
D+2
  Top 0.254: IC3.4 29.05,18.16 27.94,18.16 25.49,20.61 10.4,20.61 R34.1
D-2
  Top 0.254: IC3.3 28.11,18.56 25.4,21.27 11.81,21.27 R33.1
GND  (via drill 0.35)
  Top 0.254: U$44.P4 8.62,13.13 v8.89,12.86 | v31.43,43.66 31.34,43.75 R25.1 29.11,43.75 28.33,44.53 25.62,44.53 C30.2 24.73,45.12 23.9,44.3 23.9,42.79 C15.2 | IC3.5 32.12,17.56 IC3.THERMAL | IC3.THERMAL 32.62,18.12 30.72,20.02 30.72,20.44 IC3.43 30.62,21.45 v30.16,21.91 | IC3.35 34.62,19.06 IC3.THERMAL | IC3.23 35.12,14.56 IC3.THERMAL | IC3.15 31.72,13.68 31.72,14.1 32.62,15.01 IC3.THERMAL | J18.P4 4.22,12.49 J18.P2 | C18.2 31.27,25.03 25MHZ1.2 31.56,25.55 32.39,26.38 32.39,26.99 32.5,27.09 25MHZ1.4 34.1,26.31 34.1,26.07 34.88,25.29 C17.2
  Top 0.305: v9.84,11.91 10.07,12.13 U$44.P14 U$44.P15 | U$44.PAD 10.57,12.38 U$44.P15 | U$44.P15 10.07,12.63 v9.84,12.86
  Bottom 0.254: v31.43,43.66 31.59,43.5 v34.29,43.5 | C5.2 21.2,22.3 21.27,22.23 | v30.16,21.91 28.22,23.85 C7.2 | 25MHZ1.4 33.34,27.07 33.34,26.99 | Y2.2 29.79,9.79 29.85,9.84
  other vias: 8.89,11.91 21.13,22.3 19.36,24 15.76,17.46 21.13,42.49 28.22,25.03 33.31,27.09 40.58,17.78 29.75,9.79
  pour Top: -0.95,55.88 84.45,55.88 84.45,-4.76 -0.95,-4.76
  pour Bottom: -4.76,59.05 88.9,59.05 88.9,-7.3 -4.76,-7.3
INT  (via drill 0.35)
  Top 0.254: R32.1 39.63,26.7 v40.24,26.7 | v39.71,34.62 38.37,34.62 U1.36
  Bottom 0.254: v40.24,26.7 40.24,30.27 40.21,30.29 40.21,31.3 40.36,31.45 40.36,33.97 v39.71,34.62
LNKLED  (via drill 0.35)
  Top 0.254: v34.93,30.16 34.12,30.97 U1.25
  Bottom 0.254: 34.72,29.96 v34.93,30.16 30.39,30.16 29.46,29.24 21.94,29.24 19.34,26.64 16.54,26.64 16.24,26.94 | 16.22,26.93 16.24,26.94 | X1.14 7.07,26.71 10.01,29.65 13.53,29.65 16.24,26.94
MISO  (via drill 0.35)
  Top 0.254: IC3.11 27.62,14.56 v27.49,14.44 | U1.34 38.5,33.09 38.56,33.09 39.63,32.02 v39.63,31.67 40.87,30.43 42.05,30.43 42.09,30.4 v42.87,30.4 | v67.63,30.4 67.66,30.43 B1.MISO
  Bottom 0.254: v27.49,14.44 28.03,14.98 30.34,14.98 37.64,22.27 37.64,23.54 39.63,25.53 v39.63,31.67 | v42.87,30.4 v67.63,30.4
MOSI  (via drill 0.35)
  Top 0.254: IC3.10 27.17,15.06 v27.05,15.18 | U1.35 37.68,34.64 38.81,33.52 39.69,33.52 | v39.75,33.52 39.69,33.52 | 39.69,33.52 39.69,33.02 41.7,31 v42.34,31 | v67.95,31.43 74.29,31.43 v74.61,31.12
  Bottom 0.254: v27.05,15.18 27.26,15.38 30.18,15.38 37.24,22.44 37.24,23.71 39.02,25.5 39.02,32.79 v39.75,33.52 | v74.61,31.12 75.12,30.61 75.12,29.92 75.83,29.21 76.74,29.21 78.06,27.89 B1.MOSI | v42.34,31 67.52,31 v67.95,31.43
N$22
  Top 0.254: C5.1 22.2,25.07 22.2,25.25 22.56,25.61 23.7,25.61 23.91,25.81 23.91,32.21 24.09,32.38 26.08,32.38 26.37,32.1 26.57,32.1 26.71,31.96 29.74,31.96 U1.20
N$24
  Top 0.254: C6.1 20.23,23.17 21.75,23.17 22.12,23.54 23.7,23.54 23.86,23.7 23.86,25.2 25,25.2 25.94,26.14 25.94,27.41 27.94,29.41 27.94,30.16 28.29,30.51 28.83,30.51 28.99,30.67 29.87,30.67 U1.22
N$27
  Top 0.254: U1.10 26.67,39.96 26.67,43.18 27.24,43.75 R25.2
N$28  (via drill 0.35)
  Top 0.254: R29.1 v23.05,28.11 | v23.05,28.11
  Bottom 0.254: v23.05,28.11 23.05,24.66 C27.1
  other vias: 23.03,24.32
N$29  (via drill 0.35)
  Top 0.254: C17.1 35.27,27.13 | U1.31 36.24,33.19 36.9,32.53 36.9,30.7 34.88,28.68 C17.1 | 33.65,25.09 25MHZ1.3 33.31,25.11 v33.02,25.4 | 34.67,26.73 C17.1 | v34.82,26.79 | v34.82,26.79 C17.1
  Bottom 0.254: v33.02,25.4 34.41,26.79 v34.82,26.79
N$30
  Top 0.254: C18.1 30.27,27.09 31.43,27.09 | 31.43,27.09 25MHZ1.1 | U1.30 36.39,32.36 36.49,32.36 36.49,30.87 35.18,29.56 31.78,29.56 31.43,29.21 31.43,27.09
N$31
  Top 0.254: Y2.3 29.12,10.36 29.12,10.76 30.11,11.75 31.41,11.75 32.12,12.46 IC3.16
N$32
  Top 0.254: Y2.1 32.62,11.46 IC3.17
N$33  (via drill 0.35)
  Top 0.254: J18.3 4.9,16.36 6.14,16.36 6.36,16.59 v6.98,16.59
  Bottom 0.254: v6.98,16.59 7.43,17.03 R34.2
  other vias: 7.43,21.88
N$34  (via drill 0.35)
  Top 0.254: J18.2 6.05,16.84 v6.67,17.46
  Bottom 0.254: v6.67,17.46 6.67,23.2 R33.2
  other vias: 7.43,23.95
N$39
  Top 0.254: R45.2 42.28,19.48 D16.C
N$40  (via drill 0.35)
  Top 0.254: X1.13 8.82,27.2 8.82,26.78 11.61,24 12.03,24 12.04,23.98 14.52,23.98 14.53,24 R31.2
  other vias: 17.55,24
N$41  (via drill 0.35)
  Bottom 0.254: R30.2 14.75,42.46 14.52,42.69 9.5,42.69 X1.11
  other vias: 19.23,42.46
N$42
  Top 0.254: 9.12,10.39 U$44.P10 9.12,10.13 9.08,10.09 9.08,8.59 C42.1
N$43
  Top 0.254: U$44.P13 U$44.P12 10.48,10.57 10.48,9.68 10.91,9.25 C42.2
  Top 0.305: D17.C 11.11,14.83 U$44.P1 U$44.P16 13.06,13.13 13.81,12.38 13.8,12.37 L4.P$1 11.97,10.48 U$44.P13
N$44  (via drill 0.35)
  Top 0.813: R46.1 15.43,22.73 v15.56,22.86 | v18.73,25.72 19.75,26.73 X1.9
  Bottom 0.813: v15.56,22.86 16.67,23.97 16.67,24.37 18.02,25.72 v18.73,25.72
RD+
  Top 0.254: C20.2 21.27,28.16 21.27,37.78 20,39.05 X1.1
RD-
  Top 0.254: C26.2 22.92,31.43 22.23,31.43 21.91,31.75 21.91,39.05 20.92,40.04 19.34,40.04 18.76,39.46 18.76,39.4 17.2,37.84 X1.2
RDN  (via drill 0.35)
  Top 0.254: R29.2 C26.1 | C26.1 24.94,31.75 | U1.5 30.3,39.9 29.74,40.47 29.74,40.87 v29.38,41.22 | v25.75,34.01 25.75,34.14 26.37,34.76 26.37,36.85 v26.67,37.15 | C26.1 25.53,31.57 v25.72,31.75
  Bottom 0.254: v26.67,37.15 26.67,40.32 27.33,40.99 28.83,40.99 29.06,41.22 v29.38,41.22 | v25.72,31.75 25.75,31.79 v25.75,34.01
RDP  (via drill 0.35)
  Top 0.254: C20.1 24.75,26.4 R28.2 26.45,29.81 v26.45,31.34 | U1.6 29.84,39.52 29.28,40.08 28.5,40.08 v28.26,40.32 | v26.67,33.34 26.67,34.48 26.78,34.59 26.78,36.2 27.32,36.73 v27.4,36.73
  Bottom 0.254: v28.26,40.32 27.4,39.46 v27.4,36.73 | v26.45,31.34 26.45,33.12 v26.67,33.34
RST  (via drill 0.35)
  Top 0.254: v30.63,12.35 30.63,13.58 IC3.13 | B1.RST_ICSP 68.53,25.35 B1.RES 41.75,6.52 SW3.4 SW3.2
  Bottom 0.254: SW3.2 30.63,6.92 v30.63,12.35
  other vias: 30.23,6.52
SCK  (via drill 0.35)
  Top 0.254: v26.9,17 26.94,16.96 26.94,16.14 27.52,15.56 IC3.9 | U1.33 36.94,33.85 v38.31,32.48 39.02,31.77 39.02,31.41 40.42,30.02 40.64,30.02 40.7,30.02 41.73,30.02 v42.23,29.53 | v67.95,29.53 74.7,29.53 B1.SCK
  Bottom 0.254: v26.9,17 26.94,16.96 26.94,16.14 27.3,15.79 30.01,15.79 36.83,22.61 36.83,24.13 38.62,25.92 38.62,32.17 v38.31,32.48 | v42.23,29.53 v67.95,29.53
SCSN_WIZ  (via drill 0.35)
  Top 0.254: IC3.8 27.88,16.06 v27.55,16.4 | U1.32 37.39,32.78 37.39,32.46 38.1,31.75 38.1,28.98 v38.01,28.89
  Bottom 0.254: v27.55,16.4 30.04,16.4 35.88,22.23 35.88,24.49 R35.2 38.01,26.62 v38.01,28.89
  other vias: 36.47,25.08
TDN  (via drill 0.35)
  Top 0.254: R27.1 v23.02,35.01 | U1.1 31.64,41.29 30.41,42.52 29.82,42.52 28.89,41.59 v28.57,41.59 | v26.04,37.78 25.76,37.51 v25.76,35.01
  Bottom 0.254: 25.8,35.01 v25.76,35.01 v23.02,35.01 22.17,35.01 20.15,32.99 17.49,32.99 X1.6 | v26.04,37.78 26.04,40.96 26.67,41.59 v28.57,41.59
TDP  (via drill 0.35)
  Top 0.254: v30.16,41.91 30.38,41.91 U1.2
  Bottom 0.254: v30.16,41.91 29.85,42.23 25.72,42.23 23.03,39.54 R26.1 20.27,33.97 X1.5
  other vias: 23.03,36.73
VBAT  (via drill 0.35, 0.65)
  Top 0.305: U$44.P11 9.66,10.89 9.66,10.49 9.68,10.47 v9.68,9.84 | 9.12,14.33 U$44.P3 U$44.P2 | 9.12,14.33 9.12,14.61 | 9.12,14.61 9.12,14.76 | 9.12,14.76 9.12,15.08 | 9.12,15.08 9.12,15.4 | 9.12,15.4 9.12,16.21 D18.C 9.41,15.92 | U$44.P2 9.62,14.29 | 9.62,14.29 9.62,14.86 | 9.62,14.86 9.62,15.08 | 9.62,15.08 9.62,15.4 | 9.62,15.4 9.62,15.71 9.41,15.92 | U$44.P2 9.12,14.33 | 9.62,14.29 9.43,14.29 9.24,14.48 | 9.24,14.48 9.12,14.61 | 9.24,14.48 9.62,14.86 | 9.12,14.76 9.43,15.08 9.62,15.08 | 9.12,15.08 9.43,15.4 9.62,15.4 | 9.12,15.4 9.41,15.69 9.41,15.92
  Top 0.406: 10.73,16.33 C32.1
  Top 0.813: C32.1 v11.11,16.51 | v13.65,27.94 13.65,38.47 15.66,40.48 C43.+
  Top 1.016: v11.11,16.51 11.07,16.55 D18.C 7.02,15.6 v6.98,15.56
  Bottom 0.305: v9.68,9.84 8.41,9.84 7.14,11.11 7.14,14.91 D18.C
  Bottom 0.813: v11.11,16.51 11.11,20.97 R46.2 13.84,23.7 14.63,23.7 15.66,24.73 15.66,26.19 14.63,27.22 14.37,27.22 v13.65,27.94 | v6.98,15.56 6.98,7.46 8.6,5.85 8.6,2.22 10.16,0.66 56.54,0.66 B1.VIN
  other vias: 8.78,15.6 12.87,22.73
VBUS
  Top 0.254: B1.5V_ICSP 78.88,29.61 77.66,28.4 77.66,27.49 76.85,26.67 76.52,26.67 76.42,26.57 69.17,26.57 50.86,8.25 33.65,8.25 32.7,7.3 27.62,7.3 25.44,9.49 25.44,19.4
  Top 0.305: 8.24,19.71 D18.A | IC3.7 29.1,16.61 28.23,16.61 25.44,19.4 25.17,19.67 19.14,19.67 18.84,19.37 14.26,19.37 14.1,19.53 9.01,19.53 D18.A | D18.A 7.55,19.3 5.72,17.46 4.76,17.46 J18.1
VCCA  (via drill 0.35)
  Top 0.254: C28.1 R26.2 R27.2 24.74,35.01 C19.1 25.21,32.82 26.16,32.82 26.48,32.7 v27.62,32.7 27.94,33.02 28.34,33.02 | C28.1 C29.1 | C29.1 | C29.1 C15.1 L3.2 | C28.1 27.47,38.45 U1.11 28.28,37.75 28.84,37.19 29.07,37.19 29.8,37.92 | 29.8,37.92 29.8,38.05 29.85,38.1 29.8,38.15 29.24,38.71 U1.8 | U1.4 30.65,40.13 31.21,39.56 31.21,39.33 29.8,37.92 | U1.15 28.53,34.19 27.97,33.62 27.97,33.39 28.34,33.02 | 28.34,33.02 28.57,33.02 29.14,33.58 U1.17 | U1.21 29.6,31.12 v28.57,31.12
  Bottom 0.254: v28.57,31.12 28.57,31.75 v27.62,32.7
WIZ_RST  (via drill 0.35)
  Top 0.254: U1.37 38.89,38.29 v38.89,38.89 | IC3.22 35.37,13.34 v35.37,12.93
  Bottom 0.254: R36.1 38.89,40.09 v38.89,38.89 38.89,36.29 40.84,34.34 40.84,24.97 38.46,22.58 38.46,21.94 37.74,21.22 37.74,15.29 v35.37,12.93 35.37,13.31
  other vias: 36.44,42.55

### Text on the board
tPlace: FUSE | 13 | RST
Document: + | + | + | + | + | + | + | + | + | + | + | +